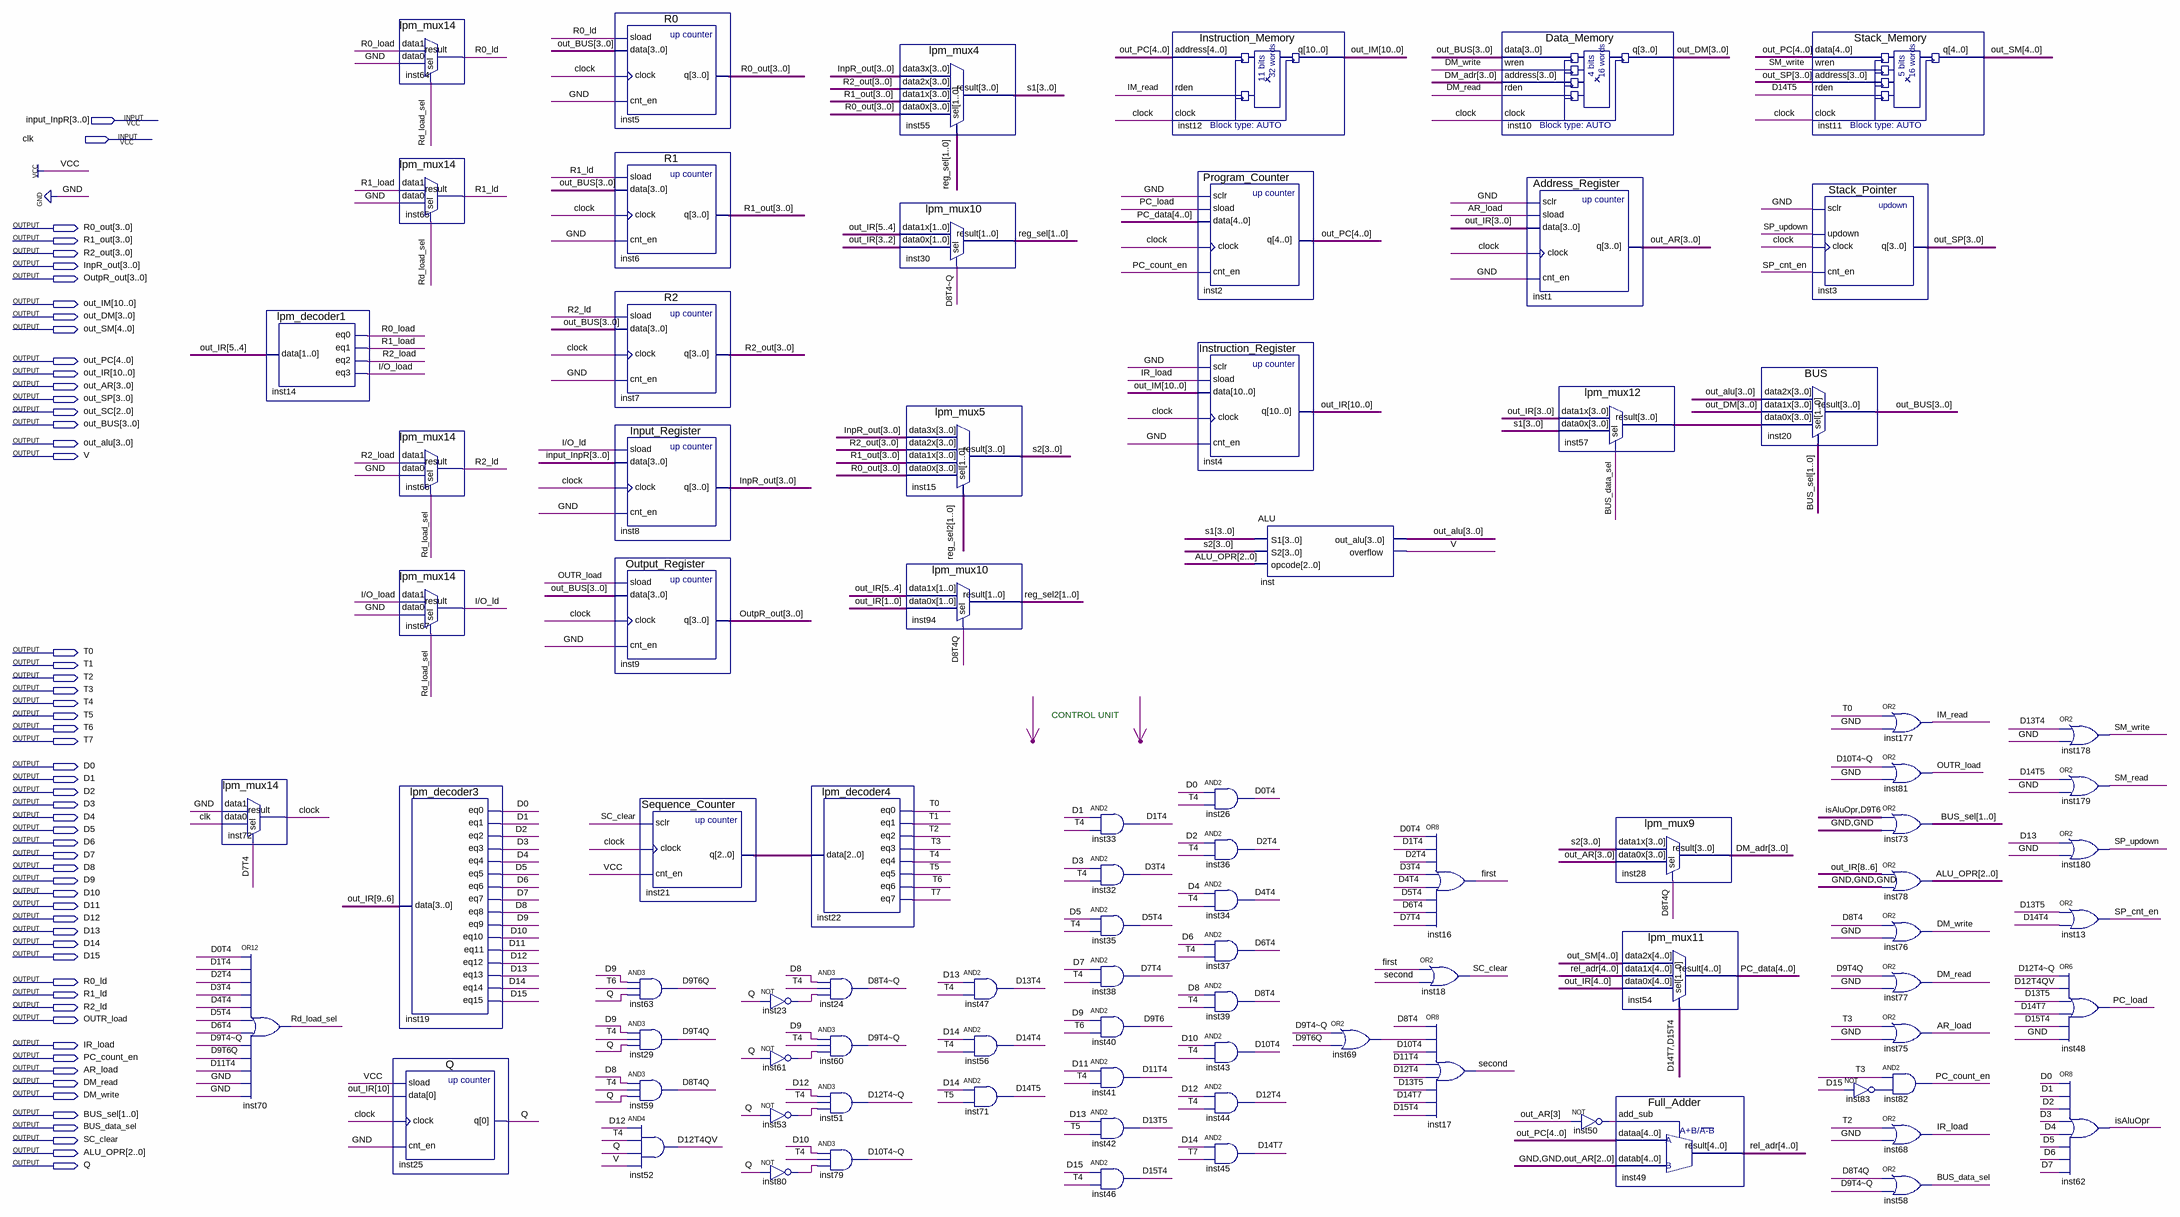
[diagram p0: schematic sheet]
// Quartus schematic Enes_Sahin_2018510093_DEUNIAC.bdf as structural Verilog: 86 symbols, 56 pins
module Enes_Sahin_2018510093_DEUNIAC (
  input  [3:0] input_InpR,
  input  clk,
  output [3:0] R0_out,
  output [3:0] R1_out,
  output [3:0] R2_out,
  output [3:0] InpR_out,
  output [3:0] OutpR_out,
  output [10:0] out_IM,
  output [3:0] out_DM,
  output [4:0] out_SM,
  output [4:0] out_PC,
  output [10:0] out_IR,
  output [3:0] out_AR,
  output [3:0] out_SP,
  output [2:0] out_SC,
  output [3:0] out_BUS,
  output [3:0] out_alu,
  output V,
  output T0,
  output T1,
  output T2,
  output T3,
  output T4,
  output T5,
  output T6,
  output T7,
  output D0,
  output D1,
  output D2,
  output D3,
  output D4,
  output D5,
  output D6,
  output D7,
  output D8,
  output D9,
  output D10,
  output D11,
  output D12,
  output D13,
  output D14,
  output D15,
  output R0_ld,
  output R1_ld,
  output R2_ld,
  output OUTR_load,
  output IR_load,
  output PC_count_en,
  output AR_load,
  output DM_read,
  output DM_write,
  output [1:0] BUS_sel,
  output BUS_data_sel,
  output SC_clear,
  output [2:0] ALU_OPR,
  output Q
);

  wire clock, D0T4, D1T4, D2T4, D3T4, D4T4, D5T4, D6T4, D7T4, D8T4, D8T4Q, \D8T4~Q , D9T4Q, \D9T4~Q , D9T6,
       D9T6Q, D10T4, \D10T4~Q , D11T4, D12T4, D12T4QV, \D12T4~Q , D13T4, D13T5, D14T4, D14T5, D14T7, D15T4,
       first, \I/O_ld , \I/O_load , IM_read, inst23_out, inst50_out, inst53_out, inst61_out, inst69_out,
       inst80_out, inst83_out, isAluOpr, PC_load, R0_load, R1_load, R2_load, Rd_load_sel, second, SM_read,
       SM_write, SP_cnt_en, SP_updown;
  wire [1:0] reg_sel, reg_sel2;
  wire [2:0] inst21_q;
  wire [3:0] DM_adr, inst57_result, s1, s2;
  wire [4:0] PC_data, rel_adr;

  lpm_mux14 inst72 (.data1(1'b0), .data0(clk), .sel(D7T4), .result(clock));
  lpm_decoder1 inst14 (.data(out_IR[5:4]), .eq0(R0_load), .eq1(R1_load), .eq2(R2_load), .eq3(\I/O_load ));
  or inst70 (Rd_load_sel, D0T4, D1T4, D2T4, D3T4, D4T4, D5T4, D6T4, \D9T4~Q , D9T6Q, D11T4, 1'b0, 1'b0);
  lpm_mux14 inst64 (.data1(R0_load), .data0(1'b0), .sel(Rd_load_sel), .result(R0_ld));
  lpm_mux14 inst65 (.data1(R1_load), .data0(1'b0), .sel(Rd_load_sel), .result(R1_ld));
  lpm_mux14 inst66 (.data1(R2_load), .data0(1'b0), .sel(Rd_load_sel), .result(R2_ld));
  lpm_mux14 inst67 (.data1(\I/O_load ), .data0(1'b0), .sel(Rd_load_sel), .result(\I/O_ld ));
  lpm_decoder3 inst19 (
    .data(out_IR[9:6]), .eq0(D0), .eq1(D1), .eq2(D2), .eq3(D3), .eq4(D4), .eq5(D5), .eq6(D6), .eq7(D7),
    .eq8(D8), .eq9(D9), .eq10(D10), .eq11(D11), .eq12(D12), .eq13(D13), .eq14(D14), .eq15(D15));
  Q inst25 (.sload(1'b1), .data(out_IR[10]), .clock(clock), .cnt_en(1'b0), .q(Q));
  R0 inst5 (.sload(R0_ld), .data(out_BUS), .clock(clock), .cnt_en(1'b0), .q(R0_out));
  R1 inst6 (.sload(R1_ld), .data(out_BUS), .clock(clock), .cnt_en(1'b0), .q(R1_out));
  R2 inst7 (.sload(R2_ld), .data(out_BUS), .clock(clock), .cnt_en(1'b0), .q(R2_out));
  Input_Register inst8 (.sload(\I/O_ld ), .data(input_InpR), .clock(clock), .cnt_en(1'b0), .q(InpR_out));
  Output_Register inst9 (.sload(OUTR_load), .data(out_BUS), .clock(clock), .cnt_en(1'b0), .q(OutpR_out));
  and inst63 (D9T6Q, D9, T6, Q);
  and inst29 (D9T4Q, D9, T4, Q);
  and inst59 (D8T4Q, D8, T4, Q);
  and inst52 (D12T4QV, D12, T4, Q, V);
  Sequence_Counter inst21 (.sclr(SC_clear), .clock(clock), .cnt_en(1'b1), .q(inst21_q));
  not inst23 (inst23_out, Q);
  not inst61 (inst61_out, Q);
  not inst53 (inst53_out, Q);
  not inst80 (inst80_out, Q);
  lpm_decoder4 inst22 (.data(inst21_q), .eq0(T0), .eq1(T1), .eq2(T2), .eq3(T3), .eq4(T4), .eq5(T5), .eq6(T6), .eq7(T7));
  and inst24 (\D8T4~Q , D8, T4, inst23_out);
  and inst60 (\D9T4~Q , D9, T4, inst61_out);
  and inst51 (\D12T4~Q , D12, T4, inst53_out);
  and inst79 (\D10T4~Q , D10, T4, inst80_out);
  lpm_mux4 inst55 (.data3x(InpR_out), .data2x(R2_out), .data1x(R1_out), .data0x(R0_out), .sel(reg_sel), .result(s1));
  lpm_mux10 inst30 (.data1x(out_IR[5:4]), .data0x(out_IR[3:2]), .sel(\D8T4~Q ), .result(reg_sel));
  lpm_mux5 inst15 (.data3x(InpR_out), .data2x(R2_out), .data1x(R1_out), .data0x(R0_out), .sel(reg_sel2), .result(s2));
  lpm_mux10 inst94 (.data1x(out_IR[5:4]), .data0x(out_IR[1:0]), .sel(D8T4Q), .result(reg_sel2));
  and inst47 (D13T4, D13, T4);
  and inst56 (D14T4, D14, T4);
  and inst71 (D14T5, D14, T5);
  and inst33 (D1T4, D1, T4);
  and inst32 (D3T4, D3, T4);
  and inst35 (D5T4, D5, T4);
  and inst38 (D7T4, D7, T4);
  and inst40 (D9T6, D9, T6);
  and inst41 (D11T4, D11, T4);
  and inst42 (D13T5, D13, T5);
  and inst46 (D15T4, D15, T4);
  Instruction_Memory inst12 (.address(out_PC), .rden(IM_read), .clock(clock), .q(out_IM));
  Program_Counter inst2 (.sclr(1'b0), .sload(PC_load), .data(PC_data), .clock(clock), .cnt_en(PC_count_en), .q(out_PC));
  Instruction_Register inst4 (.sclr(1'b0), .sload(IR_load), .data(out_IM), .clock(clock), .cnt_en(1'b0), .q(out_IR));
  and inst26 (D0T4, D0, T4);
  and inst36 (D2T4, D2, T4);
  and inst34 (D4T4, D4, T4);
  and inst37 (D6T4, D6, T4);
  and inst39 (D8T4, D8, T4);
  and inst43 (D10T4, D10, T4);
  and inst44 (D12T4, D12, T4);
  and inst45 (D14T7, D14, T7);
  ALU inst (.S1(s1), .S2(s2), .opcode(ALU_OPR), .out_alu(out_alu), .overflow(V));
  or inst69 (inst69_out, \D9T4~Q , D9T6Q);
  or inst16 (first, D0T4, D1T4, D2T4, D3T4, D4T4, D5T4, D6T4, D7T4);
  or inst18 (SC_clear, first, second);
  or inst17 (second, D8T4, inst69_out, D10T4, D11T4, D12T4, D13T5, D14T7, D15T4);
  Data_Memory inst10 (.data(out_BUS), .wren(DM_write), .address(DM_adr), .rden(DM_read), .clock(clock), .q(out_DM));
  Address_Register inst1 (.sclr(1'b0), .sload(AR_load), .data(out_IR[3:0]), .clock(clock), .cnt_en(1'b0), .q(out_AR));
  lpm_mux12 inst57 (.data1x(out_IR[3:0]), .data0x(s1), .sel(BUS_data_sel), .result(inst57_result));
  not inst50 (inst50_out, out_AR[3]);
  lpm_mux9 inst28 (.data1x(s2), .data0x(out_AR), .sel(D8T4Q), .result(DM_adr));
  lpm_mux11 inst54 (.data2x(out_SM), .data1x(rel_adr), .data0x(out_IR[4:0]), .sel({D14T7, D15T4}), .result(PC_data));
  Full_Adder inst49 (.add_sub(inst50_out), .dataa(out_PC), .datab({2'b00, out_AR[2:0]}), .result(rel_adr));
  BUS inst20 (.data2x(out_alu), .data1x(out_DM), .data0x(inst57_result), .sel(BUS_sel), .result(out_BUS));
  Stack_Memory inst11 (.data(out_PC), .wren(SM_write), .address(out_SP), .rden(D14T5), .clock(clock), .q(out_SM));
  Stack_Pointer inst3 (.sclr(1'b0), .updown(SP_updown), .clock(clock), .cnt_en(SP_cnt_en), .q(out_SP));
  not inst83 (inst83_out, D15);
  or inst177 (IM_read, T0, 1'b0);
  or inst81 (OUTR_load, \D10T4~Q , 1'b0);
  assign BUS_sel = {isAluOpr, D9T6} | 2'b00;  // OR2 inst73, 2 bits wide
  assign ALU_OPR = out_IR[8:6] | 3'b000;  // OR2 inst78, 3 bits wide
  or inst76 (DM_write, D8T4, 1'b0);
  or inst77 (DM_read, D9T4Q, 1'b0);
  or inst75 (AR_load, T3, 1'b0);
  and inst82 (PC_count_en, T3, inst83_out);
  or inst68 (IR_load, T2, 1'b0);
  or inst58 (BUS_data_sel, D8T4Q, \D9T4~Q );
  or inst178 (SM_write, D13T4, 1'b0);
  or inst179 (SM_read, D14T5, 1'b0);
  or inst180 (SP_updown, D13, 1'b0);
  or inst13 (SP_cnt_en, D13T5, D14T4);
  or inst48 (PC_load, \D12T4~Q , D12T4QV, D13T5, D14T7, D15T4, 1'b0);
  or inst62 (isAluOpr, D0, D1, D2, D3, D4, D5, D6, D7);

  // Notes on the sheet:
  //   CONTROL UNIT  
endmodule
